# EAGLE design qube (EAGLE 9.5.1)
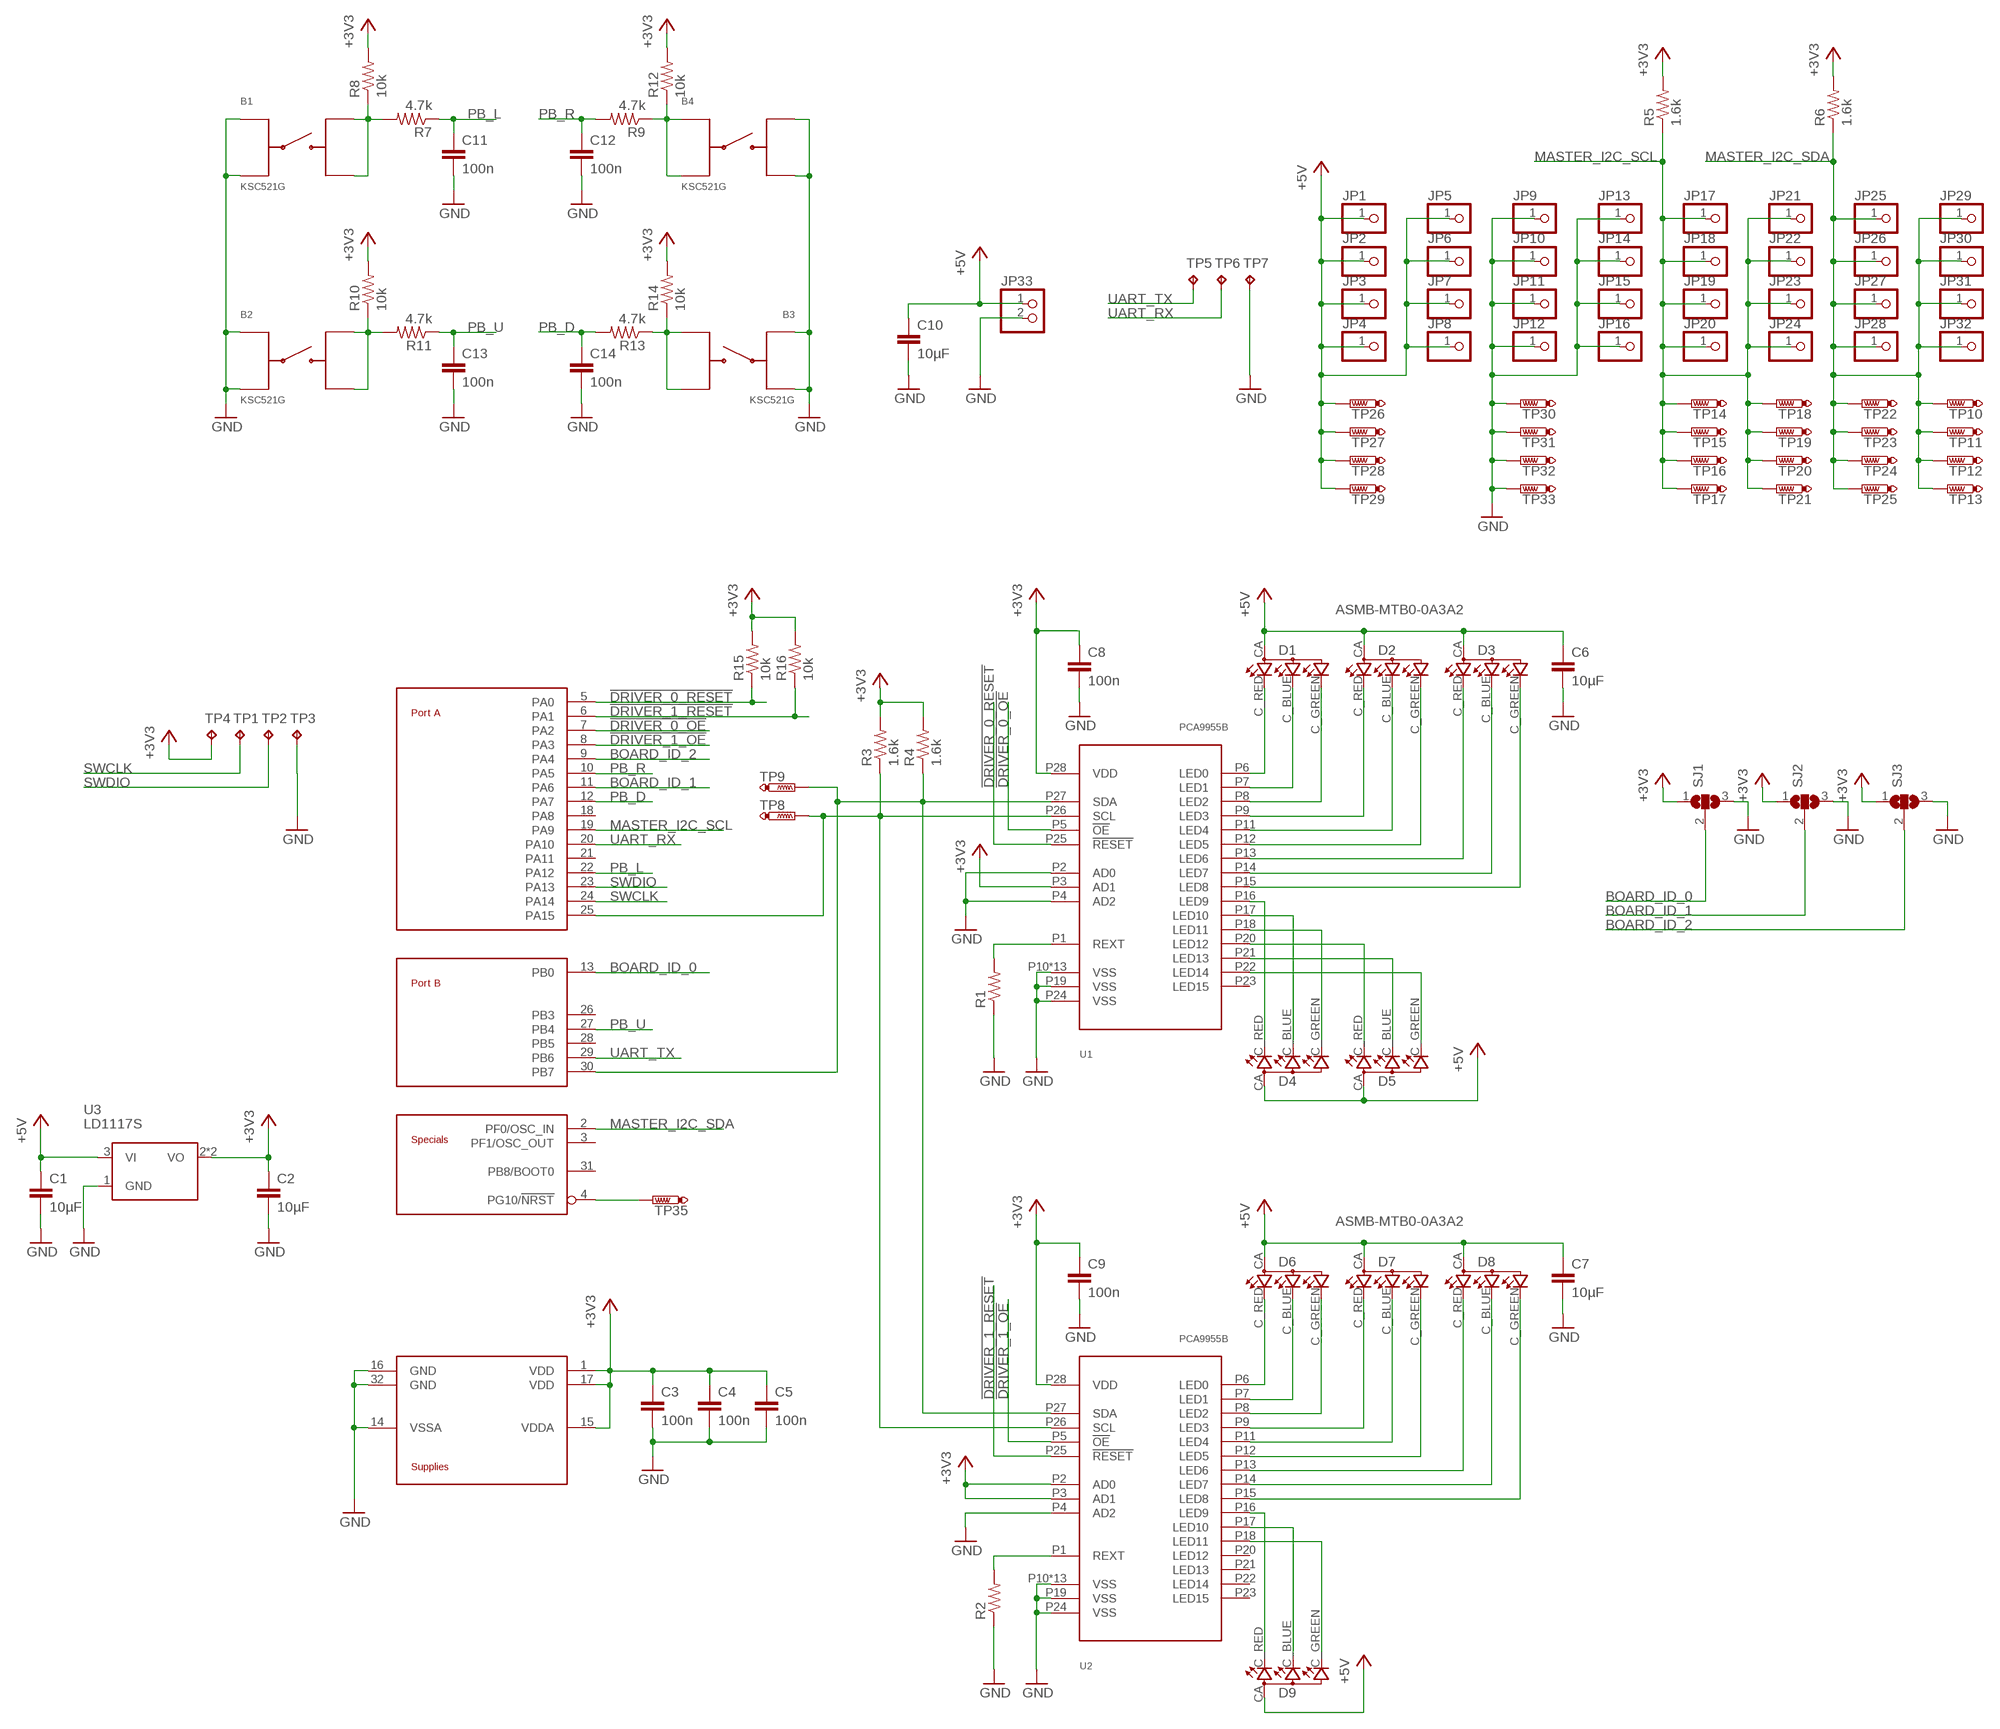
[diagram p0: schematic, sheet 1]

## Parts
B1  KSC521G  [KSC521G]
B2  KSC521G  [KSC521G]
B3  KSC521G  [KSC521G]
B4  KSC521G  [KSC521G]
C1  10µF  C-EUC0805  [C0805]
C2  10µF  C-EUC0805  [C0805]
C3  100n  C-EUC0805  [C0805]
C4  100n  C-EUC0805  [C0805]
C5  100n  C-EUC0805  [C0805]
C6  10µF  C-EUC0805  [C0805]
C7  10µF  C-EUC0805  [C0805]
C8  100n  C-EUC0805  [C0805]
C9  100n  C-EUC0805  [C0805]
C10  10µF  C-EUC0805  [C0805]
C11  100n  C-EUC0805  [C0805]
C12  100n  C-EUC0805  [C0805]
C13  100n  C-EUC0805  [C0805]
C14  100n  C-EUC0805  [C0805]
D1  ASMB-MTB0-0A3A2  [PLCC-4]
D2  ASMB-MTB0-0A3A2  [PLCC-4]
D3  ASMB-MTB0-0A3A2  [PLCC-4]
D4  ASMB-MTB0-0A3A2  [PLCC-4]
D5  ASMB-MTB0-0A3A2  [PLCC-4]
D6  ASMB-MTB0-0A3A2  [PLCC-4]
D7  ASMB-MTB0-0A3A2  [PLCC-4]
D8  ASMB-MTB0-0A3A2  [PLCC-4]
D9  ASMB-MTB0-0A3A2  [PLCC-4]
JP1  PINHD-1X1  [1X01]
JP2  PINHD-1X1  [1X01]
JP3  PINHD-1X1  [1X01]
JP4  PINHD-1X1  [1X01]
JP5  PINHD-1X1  [1X01]
JP6  PINHD-1X1  [1X01]
JP7  PINHD-1X1  [1X01]
JP8  PINHD-1X1  [1X01]
JP9  PINHD-1X1  [1X01]
JP10  PINHD-1X1  [1X01]
JP11  PINHD-1X1  [1X01]
JP12  PINHD-1X1  [1X01]
JP13  PINHD-1X1  [1X01]
JP14  PINHD-1X1  [1X01]
JP15  PINHD-1X1  [1X01]
JP16  PINHD-1X1  [1X01]
JP17  PINHD-1X1  [1X01]
JP18  PINHD-1X1  [1X01]
JP19  PINHD-1X1  [1X01]
JP20  PINHD-1X1  [1X01]
JP21  PINHD-1X1  [1X01]
JP22  PINHD-1X1  [1X01]
JP23  PINHD-1X1  [1X01]
JP24  PINHD-1X1  [1X01]
JP25  PINHD-1X1  [1X01]
JP26  PINHD-1X1  [1X01]
JP27  PINHD-1X1  [1X01]
JP28  PINHD-1X1  [1X01]
JP29  PINHD-1X1  [1X01]
JP30  PINHD-1X1  [1X01]
JP31  PINHD-1X1  [1X01]
JP32  PINHD-1X1  [1X01]
JP33  PINHD-1X2/90  [1X02/90]
R1  R-US_R0805  [R0805]
R2  R-US_R0805  [R0805]
R3  1.6k  R-US_R0805  [R0805]
R4  1.6k  R-US_R0805  [R0805]
R5  1.6k  R-US_R0805  [R0805]
R6  1.6k  R-US_R0805  [R0805]
R7  4.7k  R-US_R0805  [R0805]
R8  10k  R-US_R0805  [R0805]
R9  4.7k  R-US_R0805  [R0805]
R10  10k  R-US_R0805  [R0805]
R11  4.7k  R-US_R0805  [R0805]
R12  10k  R-US_R0805  [R0805]
R13  4.7k  R-US_R0805  [R0805]
R14  10k  R-US_R0805  [R0805]
R15  10k  R-US_R0805  [R0805]
R16  10k  R-US_R0805  [R0805]
SJ1  SJ2W  [SJ_2]
SJ2  SJ2W  [SJ_2]
SJ3  SJ2W  [SJ_2]
TP1  TPTP18R  [TP18R]
TP2  TPTP18R  [TP18R]
TP3  TPTP18R  [TP18R]
TP4  TPTP18R  [TP18R]
TP5  TPTP18R  [TP18R]
TP6  TPTP18R  [TP18R]
TP7  TPTP18R  [TP18R]
TP8  PTR1TP15SQ  [TP15SQ]
TP9  PTR1TP15SQ  [TP15SQ]
TP10  PTR1TP15SQ  [TP15SQ]
TP11  PTR1TP15SQ  [TP15SQ]
TP12  PTR1TP15SQ  [TP15SQ]
TP13  PTR1TP15SQ  [TP15SQ]
TP14  PTR1TP15SQ  [TP15SQ]
TP15  PTR1TP15SQ  [TP15SQ]
TP16  PTR1TP15SQ  [TP15SQ]
TP17  PTR1TP15SQ  [TP15SQ]
TP18  PTR1TP15SQ  [TP15SQ]
TP19  PTR1TP15SQ  [TP15SQ]
TP20  PTR1TP15SQ  [TP15SQ]
TP21  PTR1TP15SQ  [TP15SQ]
TP22  PTR1TP15SQ  [TP15SQ]
TP23  PTR1TP15SQ  [TP15SQ]
TP24  PTR1TP15SQ  [TP15SQ]
TP25  PTR1TP15SQ  [TP15SQ]
TP26  PTR1TP15SQ  [TP15SQ]
TP27  PTR1TP15SQ  [TP15SQ]
TP28  PTR1TP15SQ  [TP15SQ]
TP29  PTR1TP15SQ  [TP15SQ]
TP30  PTR1TP15SQ  [TP15SQ]
TP31  PTR1TP15SQ  [TP15SQ]
TP32  PTR1TP15SQ  [TP15SQ]
TP33  PTR1TP15SQ  [TP15SQ]
TP35  PTR1TP10R  [TP10R]
U1  PCA9955B  [HTSSOP28]
U2  PCA9955B  [HTSSOP28]
U3  LD1117S  [SOT223]
U$1  STM32G431KB  [LQFP32]

## Nets
!DRIVER_0_OE: U1.P5(!OE) U$1.7(PA2)
!DRIVER_0_RESET: R15.1 U1.P25(!RESET) U$1.5(PA0)
!DRIVER_1_OE: U2.P5(!OE) U$1.8(PA3)
!DRIVER_1_RESET: R16.1 U2.P25(!RESET) U$1.6(PA1)
+3V3: C2.1 C3.1 C4.1 C5.1 C8.1 C9.1 R3.2 R4.2 R5.2 R6.2 R8.2 R10.2 R12.2 R14.2 R15.2 R16.2 SJ1.1 SJ2.1 SJ3.1 TP4.TP U1.P3(AD1) U1.P28(VDD) U2.P2(AD0) U2.P3(AD1) U2.P28(VDD) U3.2(VO) U3.4(VO) U$1.1(VDD) U$1.15(VDDA) U$1.17(VDD)
+5V: C1.1 C6.1 C7.1 C10.1 D1.CA(A2) D2.CA(A2) D3.CA(A2) D4.CA(A2) D5.CA(A2) D6.CA(A2) D7.CA(A2) D8.CA(A2) D9.CA(A2) JP1.1 JP2.1 JP3.1 JP4.1 JP5.1 JP6.1 JP7.1 JP8.1 JP33.1 TP26.TP TP27.TP TP28.TP TP29.TP U3.3(VI)
BOARD_ID_0: SJ1.2 U$1.13(PB0)
BOARD_ID_1: SJ2.2 U$1.11(PA6)
BOARD_ID_2: SJ3.2 U$1.9(PA4)
GND: B1.3 B1.4 B2.3 B2.4 B3.3 B3.4 B4.1 B4.2 C1.2 C2.2 C3.2 C4.2 C5.2 C6.2 C7.2 C8.2 C9.2 C10.2 C11.2 C12.2 C13.2 C14.2 JP9.1 JP10.1 JP11.1 JP12.1 JP13.1 JP14.1 JP15.1 JP16.1 JP33.2 R1.1 R2.1 SJ1.3 SJ2.3 SJ3.3 TP3.TP TP7.TP TP30.TP TP31.TP TP32.TP TP33.TP U1.P2(AD0) U1.P4(AD2) U1.P10(VSS) U1.P19(VSS) U1.P24(VSS) U1.PWR_PAD1(VSS) U1.PWR_PAD2(VSS) U1.PWR_PAD3(VSS) U1.PWR_PAD4(VSS) U1.PWR_PAD5(VSS) U1.PWR_PAD6(VSS) U1.PWR_PAD7(VSS) U1.PWR_PAD8(VSS) U1.PWR_PAD9(VSS) U1.PWR_PAD10(VSS) U1.PWR_PAD11(VSS) U1.PWR_PAD12(VSS) U2.P4(AD2) U2.P10(VSS) U2.P19(VSS) U2.P24(VSS) U2.PWR_PAD1(VSS) U2.PWR_PAD2(VSS) U2.PWR_PAD3(VSS) U2.PWR_PAD4(VSS) U2.PWR_PAD5(VSS) U2.PWR_PAD6(VSS) U2.PWR_PAD7(VSS) U2.PWR_PAD8(VSS) U2.PWR_PAD9(VSS) U2.PWR_PAD10(VSS) U2.PWR_PAD11(VSS) U2.PWR_PAD12(VSS) U3.1(GND) U$1.14(VSSA) U$1.16(GND) U$1.32(GND)
MASTER_I2C_SCL: JP17.1 JP18.1 JP19.1 JP20.1 JP21.1 JP22.1 JP23.1 JP24.1 R5.1 TP14.TP TP15.TP TP16.TP TP17.TP TP18.TP TP19.TP TP20.TP TP21.TP U$1.19(PA9)
MASTER_I2C_SDA: JP25.1 JP26.1 JP27.1 JP28.1 JP29.1 JP30.1 JP31.1 JP32.1 R6.1 TP10.TP TP11.TP TP12.TP TP13.TP TP22.TP TP23.TP TP24.TP TP25.TP U$1.2(PF0/OSC_IN)
N$1: R1.2 U1.P1(REXT)
N$2: R2.2 U2.P1(REXT)
N$3: D1.C_RED(CRED) U1.P6(LED0)
N$4: D1.C_BLUE(CBLUE) U1.P7(LED1)
N$5: D1.C_GREEN(CGREEN) U1.P8(LED2)
N$6: D2.C_RED(CRED) U1.P9(LED3)
N$7: D2.C_BLUE(CBLUE) U1.P11(LED4)
N$8: D2.C_GREEN(CGREEN) U1.P12(LED5)
N$9: D3.C_RED(CRED) U1.P13(LED6)
N$10: D3.C_BLUE(CBLUE) U1.P14(LED7)
N$11: D3.C_GREEN(CGREEN) U1.P15(LED8)
N$12: D4.C_RED(CRED) U1.P16(LED9)
N$13: D4.C_BLUE(CBLUE) U1.P17(LED10)
N$14: D4.C_GREEN(CGREEN) U1.P18(LED11)
N$15: D5.C_RED(CRED) U1.P20(LED12)
N$16: D5.C_BLUE(CBLUE) U1.P21(LED13)
N$17: D5.C_GREEN(CGREEN) U1.P22(LED14)
N$18: D6.C_RED(CRED) U2.P6(LED0)
N$19: D6.C_BLUE(CBLUE) U2.P7(LED1)
N$20: D6.C_GREEN(CGREEN) U2.P8(LED2)
N$21: D7.C_RED(CRED) U2.P9(LED3)
N$22: D7.C_BLUE(CBLUE) U2.P11(LED4)
N$23: D7.C_GREEN(CGREEN) U2.P12(LED5)
N$24: D8.C_RED(CRED) U2.P13(LED6)
N$25: D8.C_BLUE(CBLUE) U2.P14(LED7)
N$26: D8.C_GREEN(CGREEN) U2.P15(LED8)
N$27: D9.C_RED(CRED) U2.P16(LED9)
N$28: D9.C_BLUE(CBLUE) U2.P17(LED10)
N$29: D9.C_GREEN(CGREEN) U2.P18(LED11)
N$30: R3.1 TP8.TP U1.P26(SCL) U2.P26(SCL) U$1.25(PA15)
N$31: R4.1 TP9.TP U1.P27(SDA) U2.P27(SDA) U$1.30(PB7)
N$32: B1.1 B1.2 R7.2 R8.1
N$33: B3.1 B3.2 R13.1 R14.1
N$34: B4.3 B4.4 R9.1 R12.1
N$35: TP35.TP U$1.4(PG10/!NRST)
N$36: B2.1 B2.2 R10.1 R11.2
PB_D: C14.1 R13.2 U$1.12(PA7)
PB_L: C11.1 R7.1 U$1.22(PA12)
PB_R: C12.1 R9.2 U$1.10(PA5)
PB_U: C13.1 R11.1 U$1.27(PB4)
SWCLK: TP1.TP U$1.24(PA14)
SWDIO: TP2.TP U$1.23(PA13)
UART_RX: TP6.TP U$1.20(PA10)
UART_TX: TP5.TP U$1.29(PB6)
Unconnected: U1.P23(LED15) U2.P20(LED12) U2.P21(LED13) U2.P22(LED14) U2.P23(LED15) U$1.3(PF1/OSC_OUT) U$1.18(PA8) U$1.21(PA11) U$1.26(PB3) U$1.28(PB5) U$1.31(PB8/BOOT0)

## Library data of the parts
B1-B4 = qb_lib:KSC521G: KSC521G Boutton poussoir de C&K COMPONENTS. Référence Farnell : 2845724
C1-C14 = rcl:C-EU: CAPACITOR, European symbol; SPICEPREFIX: C
D1-D9 = qb_lib:ASMB-MTB0-0A3A2
JP1-JP32 = pinhead:PINHD-1X1: PIN HEADER
JP33 = pinhead:PINHD-1X2: PIN HEADER
R1-R16 = rcl:R-US_: RESISTOR, American symbol; SPICEPREFIX: R
SJ1-SJ3 = jumper:SJ2W: SMD solder JUMPER
TP1-TP7 = testpad:TP: Test pad
TP8-TP33 TP35 = testpad:PTR1: TEST PIN
U1 U2 = qb_lib:PCA9955B
U3 = qb_lib:LD1117
U$1 = qb_lib:STM32G431

## Board
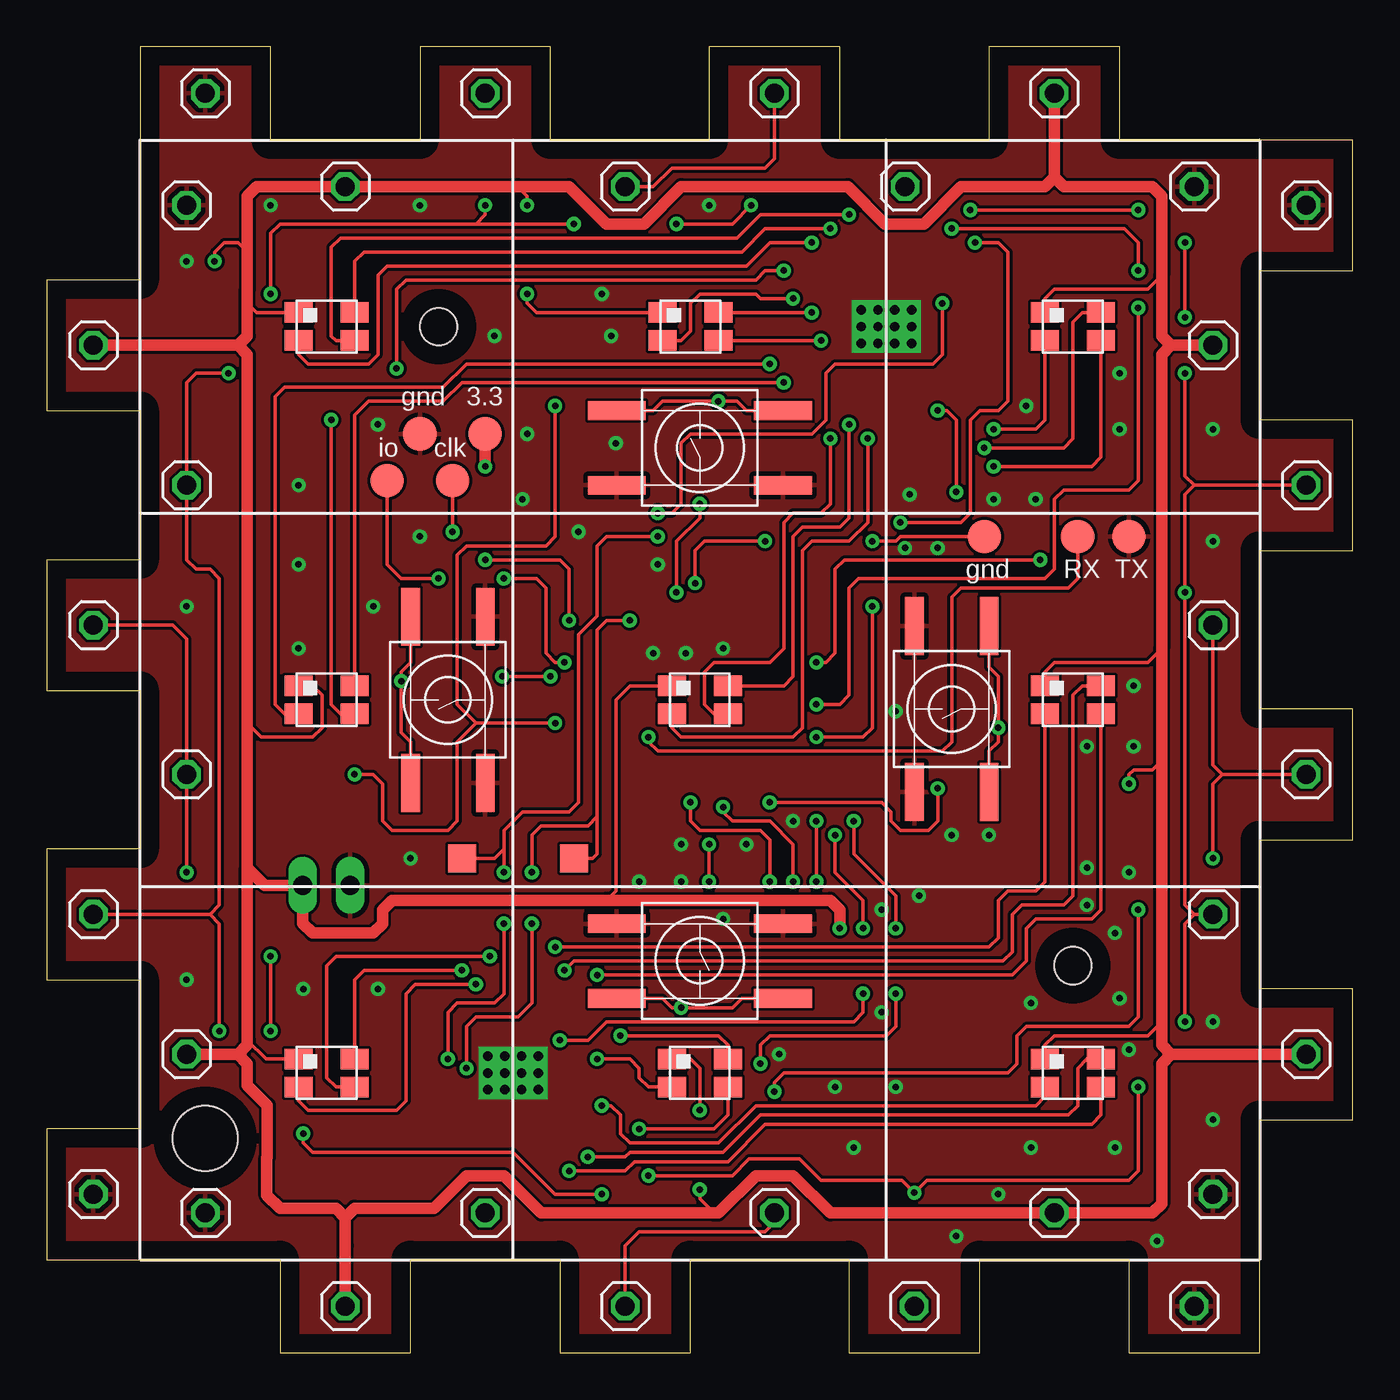
[diagram p1: board, top side]
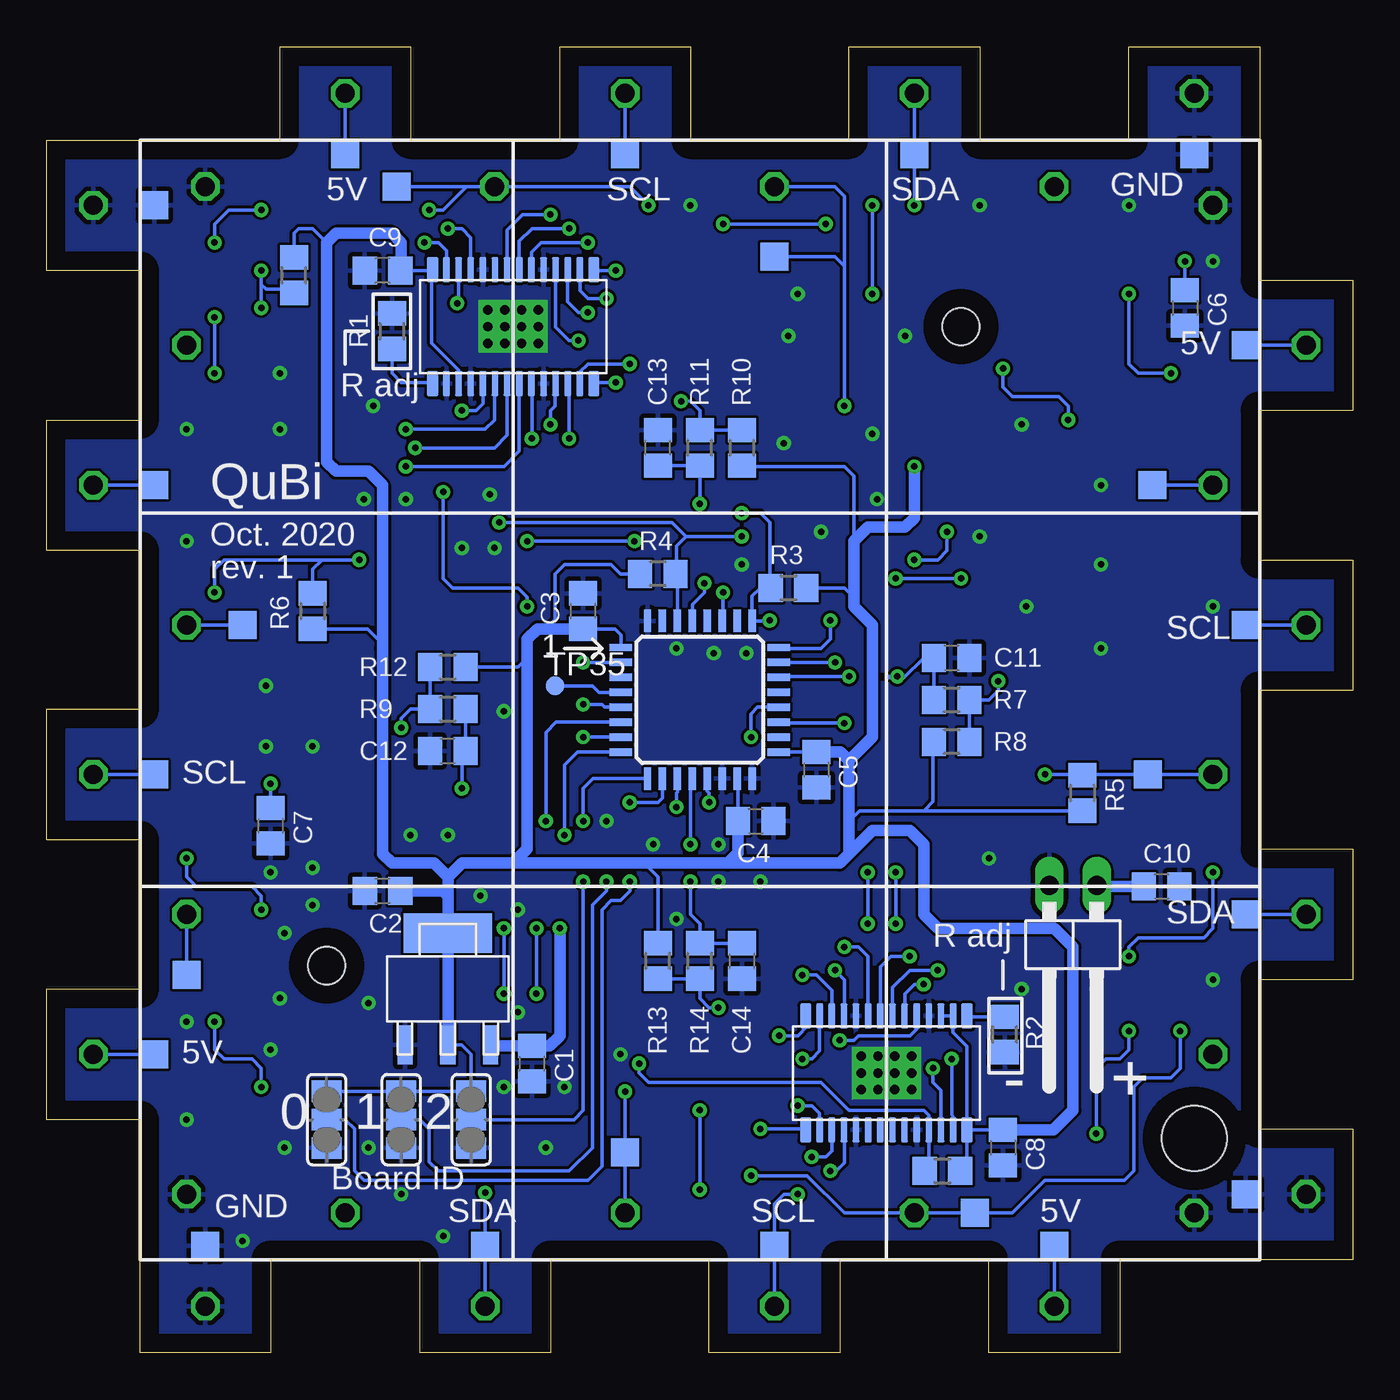
[diagram p2: board, bottom side, seen from below]

Size 70 x 70 mm. Coordinates in mm from the lower left corner, seen from the top.
Outline: 0,5 12.5,5 12.5,0 19.5,0 19.5,5 27.5,5 27.5,0 34.5,0 34.5,5 43,5 43,0 50,0 50,5 58,5 58,0 65,0 65,12.5 70,12.5 70,19.5 65,19.5 65,27.5 70,27.5 70,34.5 65,34.5 65,43 70,43 70,50 65,50 65,58 70,58 70,65 57.5,65 57.5,70 50.5,70 50.5,65 42.5,65 42.5,70 35.5,70 35.5,65 27,65 27,70 20,70 20,65 12,65 12,70 5,70 5,57.5 0,57.5 0,50.5 5,50.5 5,42.5 0,42.5 0,35.5 5,35.5 5,27 0,27 0,20 5,20 5,12 0,12 0,5
Copper layers (1*16): Top 0.035mm / dielectric 1.5mm / Bottom 0.035mm
Design rules "jlcpcb": minimum track width 5mil, minimum drill 0.3mm, track to track 6mil, track to pad 6mil, pad to pad 6mil, via to via 6mil, smd to smd 6mil, copper to edge 40mil, drill to drill 6mil, minimum pad ring 10mil, minimum via ring 8mil, stop-mask expansion 4mil, vias tented up to drill 0mil, thermal gap 10mil
Holes 3.5 mm at 8.5,11.5
Holes 2 mm at 21,55 55,20.75

### Footprints (pad centres in the part's own frame; a part is rotated, then mirrored left to right if it is on the bottom)
KSC521G = smd 3.1 x 1: 1 -4.45,2; 2 4.45,2; 3 4.45,-2; 4 -4.45,-2
C0805 = smd 1.3 x 1.5: 1 -0.95,0; 2 0.95,0
PLCC-4 = smd 1.1 x 1.5: C_BLUE -0.75,1.5; C_GREEN 0.75,1.5; C_RED 0.75,-1.5; CA -0.75,-1.5
1X01 = drill 1.016 octagon: 1 0,0
1X02/90 = drill 1.016 long: 1 -1.27,-3.81; 2 1.27,-3.81
R0805 = smd 1.3 x 1.5: 1 -0.95,0; 2 0.95,0
SJ_2 = smd 1.168 x 1.6: 1 -1.524,0; 2 0,0; 3 1.524,0
TP18R = smd 1.8 x 1.8: TP 0,0
TP15SQ = smd 1.5 x 1.5: TP 0,0
TP10R = smd 1 x 1: TP 0,0
HTSSOP28 = smd 1.35 x 0.6: P1 -3.05,4.325; P14 -3.05,-4.325; P15 3.05,-4.325; P28 3.05,4.325 | smd 1.35 x 0.4: P2 -3.05,3.575; P3 -3.05,2.925; P4 -3.05,2.275; P5 -3.05,1.625; P6 -3.05,0.975; P7 -3.05,0.325; P8 -3.05,-0.325; P9 -3.05,-0.975; P10 -3.05,-1.625; P11 -3.05,-2.275; P12 -3.05,-2.925; P13 -3.05,-3.575; P16 3.05,-3.575; P17 3.05,-2.925; P18 3.05,-2.275; P19 3.05,-1.625; P20 3.05,-0.975; P21 3.05,-0.325; P22 3.05,0.325; P23 3.05,0.975; P24 3.05,1.625; P25 3.05,2.275; P26 3.05,2.925; P27 3.05,3.575 | drill 0.5 pad 0.9 square: PWR_PAD1 -0.9,1.35; PWR_PAD2 0,1.35; PWR_PAD3 0.9,1.35; PWR_PAD4 -0.9,0.45; PWR_PAD5 0,0.45; PWR_PAD6 0.9,0.45; PWR_PAD7 -0.9,-0.45; PWR_PAD8 0,-0.45; PWR_PAD9 0.9,-0.45; PWR_PAD10 -0.9,-1.35; PWR_PAD11 0,-1.35; PWR_PAD12 0.9,-1.35
SOT223 = smd 0.813 x 2.108: 1 -2.299,-2.997; 2 0,-2.997; 3 2.299,-2.997 | smd 4.724 x 2.108: 4 0,2.997
LQFP32 = smd 1.2 x 0.4: 1 -4.225,2.8; 2 -4.225,2; 3 -4.225,1.2; 4 -4.225,0.4; 5 -4.225,-0.4; 6 -4.225,-1.2; 7 -4.225,-2; 8 -4.225,-2.8; 17 4.225,-2.8; 18 4.225,-2; 19 4.225,-1.2; 20 4.225,-0.4; 21 4.225,0.4; 22 4.225,1.2; 23 4.225,2; 24 4.225,2.8 | smd 0.4 x 1.2: 9 -2.8,-4.225; 10 -2,-4.225; 11 -1.2,-4.225; 12 -0.4,-4.225; 13 0.4,-4.225; 14 1.2,-4.225; 15 2,-4.225; 16 2.8,-4.225; 25 2.8,4.225; 26 2,4.225; 27 1.2,4.225; 28 0.4,4.225; 29 -0.4,4.225; 30 -1.2,4.225; 31 -2,4.225; 32 -2.8,4.225

### Placement (x,y rotation side)
B1  21.5,35 90 top
B2  35,48.5 0 top
B3  35,21 180 top
B4  48.5,34.5 90 top
C1  44,15.5 270 bottom
C2  52,24.75 180 bottom
C3  41.25,39.75 90 bottom
C4  32,28.5 0 bottom
C5  28.75,31.25 270 bottom
C6  9,56 270 bottom
C7  58,28.25 270 bottom
C8  18.75,11 270 bottom
C9  52,58 180 bottom
C10  10.25,25 0 bottom
C11  21.5,37.25 0 bottom
C12  48.5,32.25 180 bottom
C13  37.25,48.5 90 bottom
C14  32.75,21 270 bottom
D1  55,55 270 top
D2  35,35 270 top
D3  15,35 270 top
D4  34.5,55 270 top
D5  15,55 270 top
D6  15,15 270 top
D7  55,35 270 top
D8  35,15 270 top
D9  55,15 270 top
JP1  16,62.5 0 top
JP2  54,67.5 0 top
JP3  62.5,54 0 top
JP4  67.5,16 0 top
JP5  54,7.5 0 top
JP6  16,2.5 0 top
JP7  7.5,16 0 top
JP8  2.5,54 0 top
JP9  8.5,67.5 0 top
JP10  7.5,61.5 0 top
JP11  67.5,61.5 0 top
JP12  61.5,62.5 0 top
JP13  61.5,2.5 0 top
JP14  62.5,8.5 0 top
JP15  2.5,8.5 0 top
JP16  8.5,7.5 0 top
JP17  31,62.5 0 top
JP18  39,67.5 0 top
JP19  62.5,39 0 top
JP20  67.5,31 0 top
JP21  39,7.5 0 top
JP22  31,2.5 0 top
JP23  7.5,31 0 top
JP24  2.5,39 0 top
JP25  23.5,67.5 0 top
JP26  46,62.5 0 top
JP27  67.5,46.5 0 top
JP28  62.5,23.5 0 top
JP29  46.5,2.5 0 top
JP30  23.5,7.5 0 top
JP31  2.5,23.5 0 top
JP32  7.5,46.5 0 top
JP33  15,21.25 180 bottom
R1  51.5,54.75 270 bottom
R2  18.66,17.06 90 bottom
R3  30.25,41 0 bottom
R4  37.25,41.75 180 bottom
R5  14.5,30 270 bottom
R6  55.75,39.75 270 bottom
R7  21.5,35 0 bottom
R8  21.5,32.75 180 bottom
R9  48.5,34.5 0 bottom
R10  32.75,48.5 270 bottom
R11  35,48.5 90 bottom
R12  48.5,36.75 0 bottom
R13  35,21 90 bottom
R14  37.25,21 90 bottom
R15  56.75,57.75 90 bottom
R16  22,9.75 0 bottom
SJ1  55,12.5 270 bottom
SJ2  51,12.5 270 bottom
SJ3  47.25,12.5 270 bottom
TP1  21.75,46.75 0 top
TP2  18.25,46.75 0 top
TP3  20,49.25 0 top
TP4  23.5,49.25 0 top
TP5  50.25,43.75 0 top
TP6  55.25,43.75 0 top
TP7  58,43.75 0 top
TP8  28.25,26.5 0 top
TP9  22.25,26.5 0 top
TP10  46.5,5.75 0 bottom
TP11  20.25,7.5 0 bottom
TP12  5.75,23.5 0 bottom
TP13  10.75,46.5 0 bottom
TP14  31,58.75 0 bottom
TP15  64.25,31 0 bottom
TP16  31,5.75 0 bottom
TP17  5.75,39 0 bottom
TP18  39,64.25 0 bottom
TP19  11,31 0 bottom
TP20  39,10.75 0 bottom
TP21  59.5,39 0 bottom
TP22  23.5,64.25 0 bottom
TP23  51.25,62.5 0 bottom
TP24  64.25,46.5 0 bottom
TP25  62.5,20.25 0 bottom
TP26  54,64.25 0 bottom
TP27  64.25,16 180 bottom
TP28  16,5.75 0 bottom
TP29  5.75,54 270 bottom
TP30  8.5,64.25 0 bottom
TP31  64.25,61.5 0 bottom
TP32  61.5,5.75 0 bottom
TP33  5.75,8.5 0 bottom
TP35  42.75,35.75 0 bottom
U1  45,55 90 bottom
U2  25,15 270 bottom
U3  48.5,19.5 0 bottom
U$1  35,35 0 bottom

### Tracks (layer width: path | path; a pad name or v marks a point on that pad's centre or on a via)
!DRIVER_0_OE  (via drill 0.35)
  Top 0.2: v41.25,33 43.75,33 44.25,33.5 v44.25,40 | v47.75,50.5 48.25,50.5 48.75,50 v48.75,46.13
  Bottom 0.2: U$1.7 v41.25,33 | v47.75,50.5 47,50.5 46.62,50.88 U1.P5 | v44.25,40 44.25,40.5 44.75,41 48.25,41 48.75,41.5 v48.75,46.13
!DRIVER_0_RESET  (via drill 0.35)
  Top 0.2: v48.5,60.25 57.75,60.25 58.5,59.5 v58.5,58 | v58.5,56 58.5,46.75 58,46.25 54.5,46.25 54,45.75 54,42 53.5,41.5 43.5,41.5 43,41 43,35.25 42.5,34.75 v41.25,34.75
  Bottom 0.2: U1.P25 47.27,59.77 47.75,60.25 v48.5,60.25 | v58.5,58 58.5,57.25 | 58.5,57.25 v58.5,56 | v41.25,34.75 40.25,34.75 40.1,34.6 U$1.5 | R15.1 56.95,57 58.25,57 58.5,57.25
!DRIVER_1_OE  (via drill 0.35)
  Top 0.2: v42.25,27.75 42.25,25.75 43.75,24.25 v43.75,22.75 | v27.5,16.75 29,16.75 30,17.75 43.25,17.75 43.75,18.25 v43.75,19.25
  Bottom 0.2: U$1.8 41.55,32.2 42.25,31.5 v42.25,27.75 | U2.P5 23.38,17.38 23.75,17 26.5,17 26.75,16.75 v27.5,16.75 | v43.75,19.25 v43.75,22.75
!DRIVER_1_RESET  (via drill 0.35)
  Top 0.2: v45.5,19.25 45.5,17.5 45,17 38.75,17 38.25,16.5 v38.25,15.5 | v43.25,28.5 43.25,26.75 45.5,24.5 v45.5,22.75
  Bottom 0.2: v38.25,15.5 38.25,15 37.75,14.5 28.5,14.5 27,13 23,13 22.73,12.72 U2.P25 22.73,9.97 R16.1 | v45.5,19.25 v45.5,22.75 | v43.25,28.5 43.25,33.25 42.7,33.8 U$1.6
+3V3  (via drill 0.35)
  Top 0.61: v23.5,47.5 TP4.TP
  Bottom 0.2: C4.1 32.95,30.73 U$1.15 | U$1.17 C5.1 | C8.1 U2.P28 | C9.1 51,58 49.38,58 | 49.38,58 U1.P28 | U2.P3 U2.P2 21.43,17.18 20.68,16.43 U2.P28 | U1.P3 47.92,52.67 49.38,54.12 49.38,58 | R14.2 37.25,25.5 38,26.25 | R5.2 23,29.05 | 23,29.05 26.45,29.05 27,28.5 | R10.2 32.7,47.5 27.25,47.5 26.75,47 26.75,43.5 | C3.1 39.55,38.8 39.23,38.48 U$1.1 | 26.75,40.5 27.25,41 R3.2 | R4.2 39.25,41.75 39.75,42.25 42.25,42.25 42.75,41.75 42.75,39.3 43.25,38.8 | R8.2 22.5,32.7 22.5,29.55 23,29.05 | SJ1.1 SJ2.1 SJ3.1 47.25,16 47.75,16.5 U3.2 | 52,37.75 52,38 52.8,38.8 R6.2 | R12.2 44.75,36.75 44.25,37.25 | R16.2 20.68,10.12 U2.P28 | 55,59.5 55.75,60.25 56.5,60.25 56.75,60 R15.2
  Bottom 0.61: U3.2 U3.4 48.5,24.5 | C5.1 27.45,32.2 27,31.75 | 27,26.75 27.5,26.25 33.5,26.25 | 48.5,25.5 47.75,26.25 45,26.25 | 48.5,24.5 48.5,25.5 | 33.5,26.25 38,26.25 45,26.25 | 27,26.75 27,28.5 27,31.75 | 27,31.75 25.75,33 25.75,39 26.75,40 26.75,40.5 26.75,43.5 26,44.25 24,44.25 23.5,44.75 v23.5,47.5 | C8.1 16.05,11.95 15,13 15,21.75 16,22.75 22.25,22.75 23,23.5 23,27.25 23.75,28 25.75,28 27,26.75 | 33.5,26.25 32.95,26.8 C4.1 | 45,26.25 44.25,27 44.25,37.25 44.25,38.25 43.7,38.8 43.25,38.8 C3.1 | 48.5,25.5 49.25,26.25 51.5,26.25 52,26.75 52,37.75 52,46.5 52.75,47.25 54.5,47.25 55,47.75 55,59.5 54.5,60 51.5,60 51,59.5 51,58 | 48.5,24.5 48.75,24.75 C2.1
+5V  (via drill 0.35)
  Top 0.2: D5.CA 11.25,55.75 10.75,56.25 10.75,57 | D1.CA 53.5,56.5 54,57 59,57 59.75,57.75 | D7.CA 53.5,36.5 54,37 59,37 59.75,37.75 | D8.CA 34.5,15.75 35,15.25 v35,13 | v35,8.75 35,8.25 35.75,7.5 | D9.CA 53.5,16.5 54,17 59,17 59.75,17.75 | 25.25,62.5 25.75,62 v25.75,61.5 | v25.75,56.75 25.75,56.25 26.25,55.75 D4.CA | 10.75,16.75 11.75,15.75 D6.CA | D2.CA 31.25,35.75 30.5,35 30.5,24.75 30,24.25 | D3.CA 14.25,35.75 14.75,35.25 14.75,33.5 14.25,33 11.5,33 10.75,33.75 | v9,58.5 9,59 9.5,59.5 10.25,59.5 10.75,59 | v58,30.5 58,31 58.25,31.25 59.25,31.25 59.75,31.75
  Top 0.61: 10.75,26 10.75,33.75 10.75,53.5 10.25,54 | 10.75,26 11.69,25.06 JP33.1 13.73,23.02 14.25,22.5 17.5,22.5 18,23 18,23.75 18.5,24.25 30,24.25 42,24.25 42.5,23.75 v42.5,22.75 | JP3.1 60.25,54 | 60.25,54 59.75,54.5 59.75,57.75 59.75,62 59.25,62.5 54.5,62.5 54,63 | 60.25,54 59.75,53.5 59.75,37.75 59.75,31.75 59.75,17.75 59.75,16.5 60.25,16 | JP4.1 60.25,16 | 60.25,16 59.75,15.5 59.75,8 59.25,7.5 JP5.1 42,7.5 40,9.5 38,9.5 36,7.5 35.75,7.5 26.5,7.5 24.5,9.5 22.5,9.5 20.75,7.75 16.5,7.75 16,7.25 | 16,7.25 15.5,7.75 12.5,7.75 11.8,8.45 11.8,10.45 11.82,10.48 11.82,13.27 10.75,14.34 10.75,15.5 10.25,16 | JP6.1 TP28.TP 16,7.25 | 10.25,16 10.75,16.5 10.75,16.75 10.75,26 | JP7.1 10.25,16 | 10.25,54 10.75,54.5 10.75,57 10.75,59 10.75,62 11.25,62.5 JP1.1 25.25,62.5 28,62.5 30,60.5 32,60.5 34,62.5 42.93,62.5 44.93,60.5 47,60.5 49,62.5 53.5,62.5 54,63 | JP8.1 10.25,54 | JP2.1 54,63
  Bottom 0.2: 46.15,16.45 U3.3 | v35,13 v35,8.75 | v25.75,61.5 v25.75,56.75 | C6.1 v9,58.5 | C7.1 v58,30.5 | TP26.TP JP2.1 | TP27.TP JP4.1 | JP8.1 TP29.TP | JP6.1 TP28.TP
  Bottom 0.61: v42.5,22.75 42.5,17 43.05,16.45 C1.1 46.15,16.45 | JP33.1 13.67,25 C10.1
BOARD_ID_0  (via drill 0.35)
  Top 0.2: v38.75,25.25 38.75,27.5 38.25,28 35,28 34.5,28.5 v34.5,29.5
  Bottom 0.2: SJ1.2 54,12.5 53.5,12 53.5,9.75 53,9.25 41,9.25 40.25,10 40.25,23.75 39.75,24.25 39.25,24.25 38.75,24.75 v38.75,25.25 | v34.5,29.5 34.5,30 34.6,30.1 U$1.13
BOARD_ID_1  (via drill 0.35)
  Top 0.2: v40,25.25 40,27.25 38.75,28.5 36.75,28.5 36.25,29 v36.25,29.25
  Bottom 0.2: SJ2.2 50,12.5 49.5,12 49.5,10.25 49,9.75 42,9.75 40.75,11 40.75,24 40,24.75 v40,25.25 | U$1.11 36.2,30.05 36.25,30 v36.25,29.25
BOARD_ID_2  (via drill 0.35)
  Top 0.2: v41.25,25.25 v41.25,28.5
  Bottom 0.2: SJ3.2 41.75,12.5 41.25,13 v41.25,25.25 | U$1.9 40.73,30.77 41.25,30.25 v41.25,28.5
GND  (via drill 0.35)
  other vias: 7.5,58.5 20,61.5 12,61.5 7.5,40 7.5,20 13.75,19.5 19.5,26.5 51,8.5 57.25,11 62.5,12.5 59.5,6 62.5,17.75 48.5,27.75 32.5,37.5 34.25,37.5 32.75,42.25 28.5,44 25.5,45.75 25.75,49.25 30.5,48.75 47.75,43.13 46,43.13 45.5,34.39 34,27.25 37.5,27.25 50.5,27.75 55.75,32.5 55.75,26 55.75,24 58.25,35.75 58.25,32.5 62.5,43.5 62.5,49.5 57.5,52.5 57.5,49.5 53,45.75 50.75,45.75 46.25,46 52.5,50.75 35.5,61.5 42.25,14.25 44.75,23.75 44.75,18.25 57.25,22.5 58,25.75 57.5,19 13.5,37.75 13.5,42.25 13.5,46.5 17.5,40 20,43.75 17.75,49.75 24,54.5 30.25,54.5 29.75,56.75 46.75,24.5 52.75,18.75 39.25,16 58,16.25 48.75,6.25 45.5,14.25 43.25,11 52.75,11 17.75,19.5 31.75,25.25 34,25.25 36.25,23.25 40,28.5 36.25,37.75
  pour Bottom: 70,65 57.5,65 57.5,70 50.5,70 50.5,65 42.5,65 42.5,70 35.5,70 35.5,65 27,65 27,70 20,70 20,65 12,65 12,70 5,70 5,57.5 0,57.5 0,50.5 5,50.5 5,42.5 0,42.5 0,35.5 5,35.5 5,27 0,27 0,20 5,20 5,12 0,12 0,5 12.5,5 12.5,0 19.5,0 19.5,5 27.5,5 27.5,0 34.5,0 34.5,5 43,5 43,0 50,0 50,5 58,5 58,0 65,0 65,12.5 70,12.5 70,19.5 65,19.5 65,27.5 70,27.5 70,34.5 65,34.5 65,43 70,43 70,50 65,50 65,58 70,58
  pour Top: 5,57.5 5,70 12,70 12,65 20,65 20,70 27,70 27,65 35.5,65 35.5,70 42.5,70 42.5,65 50.5,65 50.5,70 57.5,70 57.5,65 70,65 70,58 65,58 65,50 70,50 70,43 65,43 65,34.5 70,34.5 70,27.5 65,27.5 65,19.5 70,19.5 70,12.5 65,12.5 65,0 58,0 58,5 50,5 50,0 43,0 43,5 34.5,5 34.5,0 27.5,0 27.5,5 19.5,5 19.5,0 12.5,0 12.5,5 0,5 0,12 5,12 5,20 0,20 0,27 5,27 5,35.5 0,35.5 0,42.5 5,42.5 5,50.5 0,50.5 0,57.5
MASTER_I2C_SCL  (via drill 0.35)
  Top 0.2: JP24.1 6.75,39 7.5,38.25 JP23.1 v7.5,25.75 | JP21.1 39,7 38.5,6.5 31.75,6.5 TP16.TP JP22.1 | JP18.1 39,64 38.5,63.5 33.5,63.5 32.5,62.5 JP17.1 | v58.5,23.75 58.5,18 58,17.5 52.5,17.5 52,17 52,15.5 51.5,15 39.5,15 39,14.5 v39,14 | 23,33.75 22,32.75 22,28.5 21.5,28 18.5,28 18,28.5 18,30.5 17.5,31 v16.5,31 | v27.25,33.75 23,33.75 | 23,33.75 22,34.75 22,42.75 22.5,43.25 26.75,43.25 27.25,43.75 v27.25,50.75 | v12,21.25 v12,17.25 | 63,31 62.5,31.5 JP19.1 | JP20.1 63,31 | 63,31 62.5,30.5 v62.5,26.5 | v29.75,8.5 27.25,8.5 25,10.75 14.25,10.75 13.75,11.25 v13.75,11.75
  Bottom 0.2: 14.45,31 R5.1 | U$1.19 30.73,33.75 v27.25,33.75 | v16.5,31 14.45,31 | v58.5,23.75 58.5,24.5 59,25 62,25 62.5,25.5 v62.5,26.5 | JP17.1 27.75,62.5 27.25,62 27.25,58.25 | v7.5,25.75 7.5,22.75 8,22.25 11.5,22.25 12,21.75 v12,21.25 | v12,17.25 12,16.25 12.5,15.75 13.25,15.75 13.75,15.25 v13.75,11.75 | v27.25,50.75 27.25,58.25 | JP22.1 TP16.TP 31,8 30.5,8.5 v29.75,8.5 | JP20.1 TP15.TP | TP18.TP JP18.1 | TP17.TP JP24.1 | v39,14 TP20.TP JP21.1 | TP21.TP JP19.1 | JP23.1 TP19.TP 14.45,31 | 27.25,58.25 27.75,58.75 TP14.TP
MASTER_I2C_SDA  (via drill 0.35)
  Top 0.2: JP28.1 61.5,23.5 | 61.5,23.5 61,24 v61,40.75 61,46 61.5,46.5 | 61.5,23.5 61,23 v61,17.75 | v58.5,14.25 58.5,9.75 58,9.25 47.16,9.25 v46.5,8.59 45.84,9.25 41.5,9.25 40.35,10.4 37.65,10.4 36.75,9.5 v32.25,9.5 | v9.75,52.5 8,52.5 7.5,52 JP32.1 7.5,42.5 8,42 8.75,42 9.25,41.5 9.25,24 8.75,23.5 | v12,56.75 12,60 12.5,60.5 23,60.5 | 23,60.5 23.5,61 v23.5,61.5 | 23,60.5 v28.25,60.5 | v37.75,61.5 36.75,60.5 v33.75,60.5 | v61,59.5 v61,55.5 | v49.5,61.25 v58.5,61.25 | v41.25,37 41.75,37 42.25,37.5 42.25,42 42.75,42.5 v53.25,42.5 | 61.5,46.5 61,47 v61,52.5 | JP27.1 61.5,46.5 | JP31.1 8.75,23.5 | 8.75,23.5 9.25,23 v9.25,17.25
  Bottom 0.2: v61,17.75 61,16.25 60.5,15.75 59,15.75 58.5,15.25 v58.5,14.25 | v9.75,52.5 11.5,52.5 12,53 v12,56.75 | v28.25,60.5 v33.75,60.5 | 47.5,62.5 JP26.1 38.75,62.5 v37.75,61.5 | v49.5,61.25 48.75,61.25 47.5,62.5 | v58.5,61.25 60.25,61.25 61,60.5 v61,59.5 | v61,55.5 v61,52.5 | U$1.2 v41.25,37 | v61,40.75 61,42 60.5,42.5 55.25,42.5 | v53.25,42.5 55.25,42.5 | v32.25,9.5 29.25,9.5 27.25,7.5 JP30.1 TP11.TP 18.25,7.5 16.5,9.25 12.25,9.25 11.75,9.75 11.75,14.25 11.25,14.75 9.75,14.75 9.25,15.25 v9.25,17.25 | 55.25,42.5 55.75,42 R6.1 | v23.5,61.5 TP22.TP JP25.1 | 47.5,62.5 TP23.TP | TP24.TP JP27.1 | TP25.TP JP28.1 | v46.5,8.59 TP10.TP JP29.1 | TP13.TP JP32.1 | JP31.1 TP12.TP
N$1
  Bottom 0.2: U1.P1 49.38,52 51,52 51.5,52.5 R1.2
N$2
  Bottom 0.2: U2.P1 20.63,18.01 R2.2
N$3  (via drill 0.35)
  Top 0.2: v50.75,49.5 53,49.5 53.5,50 D1.C_RED
  Bottom 0.2: U1.P6 46,51.92 46,50 46.5,49.5 v50.75,49.5
N$4  (via drill 0.35)
  Top 0.2: v50.25,48.5 54.5,48.5 55,49 55,55.25 55.5,55.75 D1.C_BLUE
  Bottom 0.2: U1.P7 45.33,49.17 46,48.5 v50.25,48.5
N$5  (via drill 0.35)
  Top 0.2: D1.C_GREEN 56.5,48 56,47.5 v50.75,47.5
  Bottom 0.2: U1.P8 44.67,48.33 45.5,47.5 v50.75,47.5
N$6  (via drill 0.35)
  Top 0.2: D2.C_RED 33.5,33.5 34,33 40,33 40.5,33.5 40.5,43 41,43.5 43,43.5 44,44.5 v44,49
  Bottom 0.2: U1.P9 44,51.92 v44,49
N$7  (via drill 0.35)
  Top 0.2: D2.C_BLUE 39.5,35.75 40,36.25 40,43.75 40.5,44.25 42.5,44.25 43,44.75 v43,49.75
  Bottom 0.2: U1.P11 42.75,51.92 42.75,50.75 43,50.5 v43,49.75
N$8  (via drill 0.35)
  Top 0.2: v42,49 42,45.5 41.5,45 40,45 39.5,44.5 39.5,37.75 38.75,37 35.75,37 35.25,36.5 35.25,34.75 35.75,34.25 D2.C_GREEN
  Bottom 0.2: U1.P12 42,51.88 v42,49
N$9  (via drill 0.35)
  Top 0.2: v38.75,53 22.5,53 21.25,51.75 12.75,51.75 12.25,51.25 12.25,34.75 12.75,34.25 D3.C_RED
  Bottom 0.2: v38.75,53 41,53 41.42,52.58 U1.P13
N$10  (via drill 0.35)
  Top 0.2: v39.5,52 22.25,52 21.25,51 17.25,51 16.5,50.25 D3.C_BLUE
  Bottom 0.2: U1.P14 40.62,52 v39.5,52
N$11  (via drill 0.35)
  Top 0.2: v39.5,58 38.5,58 38,57.5 19.25,57.5 18.75,57 v18.75,52.75 | D3.C_GREEN 15.75,34.25 15.25,34.75 v15.25,50
  Bottom 0.2: U1.P15 40.62,58 v39.5,58 | v18.75,52.75 18.75,51.75 18.25,51.25 15.75,51.25 15.25,50.75 v15.25,50
N$12  (via drill 0.35)
  Top 0.2: D4.C_RED 34,54.25 34.5,54.75 34.5,56.25 35,56.75 38,56.75 38.25,56.5 v40,56.5
  Bottom 0.2: v40,56.5 41,56.5 41.42,56.92 U1.P16
N$13  (via drill 0.35)
  Top 0.2: D4.C_BLUE v41,55.75
  Bottom 0.2: v41,55.75 41.5,55.75 42.08,56.33 U1.P17
N$14  (via drill 0.35)
  Top 0.2: D4.C_GREEN v41.5,54.25
  Bottom 0.2: U1.P18 42.73,54.98 42,54.25 v41.5,54.25
N$15  (via drill 0.35)
  Top 0.2: D5.C_RED 13.5,53.5 14,53 17.25,53 17.75,53.5 17.75,57.75 18.25,58.25 37.5,58.25 38.75,59.5 v41,59.5
  Bottom 0.2: v41,59.5 43.5,59.5 44.02,58.98 U1.P20
N$16  (via drill 0.35)
  Top 0.2: D5.C_BLUE 16.5,58.5 17,59 37.25,59 38.5,60.25 v42,60.25
  Bottom 0.2: v42,60.25 44,60.25 44.67,59.58 U1.P21
N$17  (via drill 0.35)
  Top 0.2: D5.C_GREEN 15.5,54.25 15.25,54.5 15.25,59.25 15.75,59.75 37,59.75 38.25,61 v43,61
  Bottom 0.2: v43,61 44.5,61 45.33,60.17 U1.P22
N$18  (via drill 0.35)
  Top 0.2: v23,19.75 19.75,19.75 19.25,19.25 19.25,13.5 18.75,13 14,13 13.5,13.5 D6.C_RED
  Bottom 0.2: U2.P6 24,18.07 24,19.25 23.5,19.75 v23,19.75
N$19  (via drill 0.35)
  Top 0.2: v22.25,20.5 17,20.5 16.5,20 D6.C_BLUE
  Bottom 0.2: U2.P7 24.68,19.57 23.75,20.5 v22.25,20.5
N$20  (via drill 0.35)
  Top 0.2: D6.C_GREEN 15.5,14.25 15,14.75 15,20.75 15.5,21.25 v23.75,21.25
  Bottom 0.2: U2.P8 25.32,20.68 24.75,21.25 v23.75,21.25
N$21  (via drill 0.35)
  Top 0.2: v27.25,21.75 50.5,21.75 51,22.25 51,24.25 51.5,24.75 53,24.75 53.5,25.25 D7.C_RED
  Bottom 0.2: U2.P9 26,18.07 26,21.25 26.5,21.75 v27.25,21.75
N$22  (via drill 0.35)
  Top 0.2: D7.C_BLUE 55.5,35.75 55,35.25 55,24.5 54.5,24 52.25,24 51.75,23.5 51.75,21.5 51.25,21 28.25,21 v27.75,20.5
  Bottom 0.2: v27.75,20.5 27.25,20 27.25,18.07 U2.P11
N$23  (via drill 0.35)
  Top 0.2: v29.5,20.25 51.75,20.25 52.5,21 52.5,22.75 53,23.25 56,23.25 56.5,23.75 D7.C_GREEN
  Bottom 0.2: v29.5,20.25 28.75,20.25 27.93,19.43 U2.P12
N$24  (via drill 0.35)
  Top 0.2: D8.C_RED 32.25,14.25 31.75,14.75 31.75,15.25 31.25,15.75 v29.5,15.75
  Bottom 0.2: v29.5,15.75 29,15.75 28.57,16.18 U2.P13
N$25  (via drill 0.35)
  Top 0.2: D8.C_BLUE 36.5,16.5 36,17 v30.75,17
  Bottom 0.2: U2.P14 29.25,17.98 29.25,17.5 29.75,17 v30.75,17
N$26  (via drill 0.35)
  Top 0.2: D8.C_GREEN 36.5,12.75 35.75,12 v31.75,12
  Bottom 0.2: U2.P15 29.38,12 v31.75,12
N$27  (via drill 0.35)
  Top 0.2: v29.75,13.25 30.25,13.25 30.75,12.75 30.75,11.75 31.25,11.25 36,11.25 38,13.25 53,13.25 53.5,13.75 D9.C_RED
  Bottom 0.2: U2.P16 28.57,12.82 29,13.25 v29.75,13.25
N$28  (via drill 0.35)
  Top 0.2: v29,10.5 31,10.5 31.25,10.75 36.25,10.75 38.25,12.75 54.75,12.75 55.25,13.25 55.25,15.25 55.75,15.75 D9.C_BLUE
  Bottom 0.2: U2.P17 27.93,10.82 28.25,10.5 v29,10.5
N$29  (via drill 0.35)
  Top 0.2: v28,9.75 31,9.75 31.5,10.25 36.5,10.25 38.5,12.25 56,12.25 56.5,12.75 D9.C_GREEN
  Bottom 0.2: U2.P18 27.25,11.93 27.25,10.18 27.68,9.75 v28,9.75
N$30  (via drill 0.35)
  Top 0.2: v31.25,39.25 30,39.25 29.5,38.75 29.5,28.75 | 29.5,28.75 29,28.25 26.5,28.25 26,27.75 v26,25.75 | v22.5,15.25 22.5,17.5 23,18 25.25,18 26,18.75 v26,23 | v32.75,45 33.5,45 34,45.5 34,48.75 34.5,49.25 41,49.25 41.75,50 41.75,52.5 42.25,53 47.5,53 48,53.5 v48,56.25 | TP8.TP 29.25,26.5 29.5,26.75 29.5,28.75
  Bottom 0.2: v31.25,39.25 31.27,39.23 U$1.25 32.2,40.55 31.75,41 R3.1 31.25,41.05 31.25,44.5 31.75,45 v32.75,45 | v22.5,15.25 22.5,14.5 22.07,14.07 U2.P26 | v26,25.75 v26,23 | v48,56.25 47.92,56.33 U1.P26
N$31  (via drill 0.35)
  Top 0.2: v32.75,43.75 30,43.75 29.5,43.25 29.5,39.5 28.5,38.5 28.5,29.5 28,29 25.5,29 24.5,28 24.5,27 | v49.75,59.5 51,59.5 51.5,59 51.5,51 51,50.5 50,50.5 49.5,50 49.5,45 49,44.5 v45.75,44.5 | 24.5,27 v24.5,25.75 | v24.5,23 24.5,19.25 24,18.75 22,18.75 21.5,18.25 v21.5,15.75 | 24.5,27 24,26.5 TP9.TP
  Bottom 0.2: U$1.30 36.2,41.65 R4.1 36.25,41.8 36.25,43.25 35.75,43.75 | v32.75,43.75 35.75,43.75 | U1.P27 48.58,59.08 49,59.5 v49.75,59.5 | 35.75,43.75 36.5,44.5 v45.75,44.5 | v24.5,25.75 v24.5,23 | v21.5,15.75 21.5,12.75 21.43,12.68 U2.P27
N$32  (via drill 0.35)
  Top 0.2: B1.2 19.5,37 19,36.5 v19,36 19,33.25 19.5,32.75 B1.1
  Bottom 0.2: v19,36 19,35.5 19.5,35 R7.2 R8.1
N$33  (via drill 0.35)
  Top 0.2: B3.2 33,19 33.5,18.5 v34,18.5 36.75,18.5 37.25,19 B3.1
  Bottom 0.2: R14.1 R13.1 35,19 34.5,18.5 v34,18.5
N$34  (via drill 0.35)
  Top 0.2: B4.4 50.5,32.25 51,32.75 v51,33.5 51,36.25 50.5,36.75 B4.3
  Bottom 0.2: v51,33.5 51,34 50.5,34.5 R9.1 R12.1
N$35
  Bottom 0.2: U$1.4 40.4,35.4 40.75,35.75 TP35.TP
N$36  (via drill 0.35)
  Top 0.2: B2.2 37.5,50.5 37,51 v36,51 33,51 32.5,50.5 B2.1
  Bottom 0.2: v36,51 35.5,51 35,50.5 R11.2 R10.1
PB_D  (via drill 0.35)
  Top 0.2: v35.5,25.25 v35.5,27.25
  Bottom 0.2: C14.1 R13.2 35,23 35.5,23.5 v35.5,25.25 | U$1.12 35.5,30.68 v35.5,27.25
PB_L  (via drill 0.35)
  Top 0.2: v24.41,36.25 v27,36.25
  Bottom 0.2: R7.1 C11.1 23,37.25 24.05,36.2 24.95,36.2 25,36.25 v24.41,36.25 | v27,36.25 30.73,36.25 U$1.22
PB_R  (via drill 0.35)
  Top 0.2: v38.75,29.5 44.75,29.5 45.25,29 45.25,28.5 45.75,28 47.25,28 47.75,28.5 v47.75,30.25
  Bottom 0.2: U$1.10 37,29.75 37.25,29.5 v38.75,29.5 | R9.2 C12.1 47.75,32.05 v47.75,30.25
PB_U  (via drill 0.35)
  Top 0.2: v35,45.5 35,44.75 33.75,43.5 v33.75,40.75
  Bottom 0.2: U$1.27 33.75,39.27 v33.75,40.75 | v35,45.5 R11.1 C13.1
SWCLK  (via drill 0.35)
  Top 0.2: v28,39.25 28,42 27.5,42.5 v23.5,42.5 | TP1.TP v21.75,44
  Bottom 0.2: v23.5,42.5 22.25,42.5 21.75,43 v21.75,44 | U$1.24 30.73,37.75 28.5,37.75 28,38.25 v28,39.25
SWDIO  (via drill 0.35)
  Top 0.2: v24.5,41.5 26.25,41.5 26.75,41 26.75,37.5 27.25,37 v27.75,37 | v21,41.5 19,41.5 18.25,42.25 TP2.TP
  Bottom 0.2: U$1.23 v27.75,37 | v24.5,41.5 v21,41.5
UART_RX  (via drill 0.35)
  Top 0.2: v32.25,33 32.25,32.75 32.75,32.25 48,32.25 48.5,32.75 48.5,40.5 49,41 54.75,41 55.25,41.5 TP6.TP
  Bottom 0.2: U$1.20 31.9,34.6 32.25,34.25 v32.25,33
UART_TX  (via drill 0.35)
  Top 0.2: v44.25,43.5 45.5,43.5 45.75,43.75 TP5.TP | v38.5,43.5 35.25,43.5 34.75,43 v34.75,41.25
  Bottom 0.2: v44.25,43.5 v38.5,43.5 | v34.75,41.25 34.75,40.75 35.4,40.1 U$1.29

### Text on the board
tPlace: gnd | 3.3 | io | clk | gnd | RX | TX
bPlace: GND | SDA | SCL | 5V | 5V | R adj | QuBi | Oct. 2020 | rev. 1 | SCL | 1 | SCL | SDA | R adj | 5V | + | - | 2 | 1 | 0 | Board ID | 5V | SCL | SDA | GND